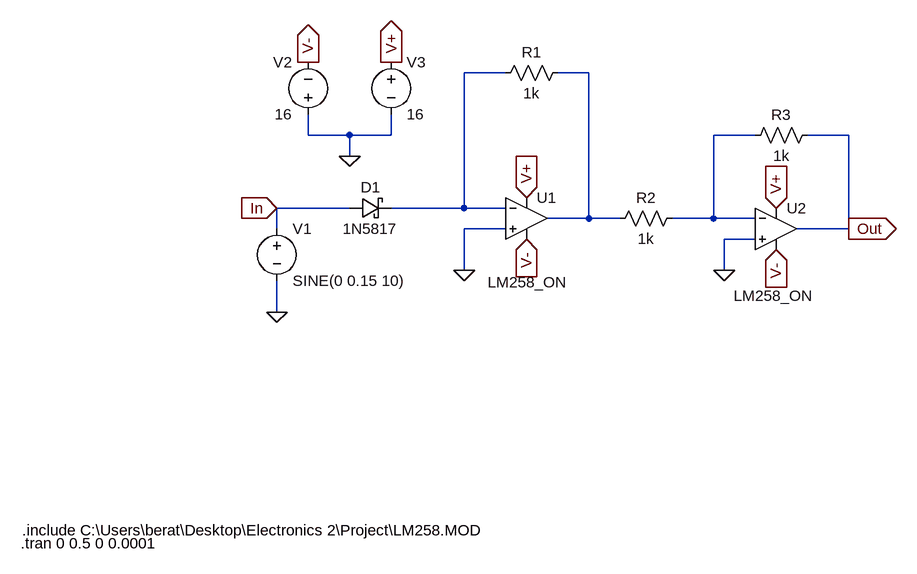
[diagram p0: schematic AntilogOpamp.asc]
AntilogOpamp.asc, the LTspice schematic file:
Version 4
SHEET 1 880 680
WIRE 112 -80 48 -80
WIRE 240 -80 192 -80
WIRE -192 16 -192 -16
WIRE -128 16 -192 16
WIRE -64 16 -64 -16
WIRE -64 16 -128 16
WIRE 496 16 432 16
WIRE 640 16 576 16
WIRE -128 48 -128 16
WIRE -128 128 -240 128
WIRE 48 128 48 -80
WIRE 48 128 -64 128
WIRE 112 128 48 128
WIRE 240 144 240 -80
WIRE 240 144 176 144
WIRE 288 144 240 144
WIRE 432 144 432 16
WIRE 432 144 368 144
WIRE 496 144 432 144
WIRE -240 160 -240 128
WIRE 112 160 48 160
WIRE 640 160 640 16
WIRE 640 160 560 160
WIRE 496 176 448 176
WIRE 48 224 48 160
WIRE 448 224 448 176
WIRE -240 288 -240 240
FLAG 48 224 0
FLAG -240 288 0
FLAG -128 48 0
FLAG -240 128 In
IOPIN -240 128 In
FLAG -64 -96 V+
IOPIN -64 -96 Out
FLAG -192 -96 V-
IOPIN -192 -96 Out
FLAG 144 112 V+
IOPIN 144 112 In
FLAG 144 176 V-
IOPIN 144 176 In
FLAG 528 128 V+
IOPIN 528 128 In
FLAG 528 192 V-
IOPIN 528 192 In
FLAG 448 224 0
FLAG 640 160 Out
IOPIN 640 160 Out
SYMBOL OpAmps\\opamp2 144 80 R0
WINDOW 3 -60 162 Left 2
SYMATTR Value LM258_ON
SYMATTR InstName U1
SYMBOL res 208 -96 R90
WINDOW 0 0 56 VBottom 2
WINDOW 3 32 56 VTop 2
SYMATTR InstName R1
SYMATTR Value 1k
SYMBOL voltage -240 144 R0
WINDOW 123 24 124 Left 2
WINDOW 39 0 0 Left 0
SYMATTR InstName V1
SYMATTR Value SINE(0 0.15 10)
SYMBOL schottky -128 144 R270
WINDOW 0 32 32 VTop 2
WINDOW 3 0 32 VBottom 2
SYMATTR InstName D1
SYMATTR Value 1N5817
SYMATTR Description Diode
SYMATTR Type diode
SYMBOL voltage -192 0 R180
WINDOW 0 24 96 Left 2
WINDOW 3 24 16 Left 2
WINDOW 123 0 0 Left 0
WINDOW 39 0 0 Left 0
SYMATTR InstName V2
SYMATTR Value 16
SYMBOL voltage -64 -112 R0
WINDOW 123 0 0 Left 0
WINDOW 39 0 0 Left 0
SYMATTR InstName V3
SYMATTR Value 16
SYMBOL res 384 128 R90
WINDOW 0 0 56 VBottom 2
WINDOW 3 32 56 VTop 2
SYMATTR InstName R2
SYMATTR Value 1k
SYMBOL OpAmps\\opamp2 528 96 R0
WINDOW 3 -65 167 Left 2
SYMATTR Value LM258_ON
SYMATTR InstName U2
SYMBOL res 592 0 R90
WINDOW 0 0 56 VBottom 2
WINDOW 3 32 56 VTop 2
SYMATTR InstName R3
SYMATTR Value 1k
TEXT -632 624 Left 2 !.include C:\\Users\\berat\\Desktop\\Electronics 2\\Project\\LM258.MOD
TEXT -634 644 Left 2 !.tran 0 0.5 0 0.0001

The netlist it stands for:
* AntilogOpamp.asc
XU1 0 N001 V+ V- N002 LM258_ON  ; pins In+ In- V+ V- OUT
R1 N002 N001 1k
V1 In 0 SINE(0 0.15 10)
D1 In N001 1N5817
V2 0 V- 16
V3 V+ 0 16
R2 N003 N002 1k
XU2 0 N003 V+ V- Out LM258_ON  ; pins In+ In- V+ V- OUT
R3 Out N003 1k
.model D D
.lib standard.dio
.include C:\Users\berat\Desktop\Electronics 2\Project\LM258.MOD
.tran 0 0.5 0 0.0001
.backanno
.end